# EAGLE design Sychronome driver (EAGLE 7.2.0)
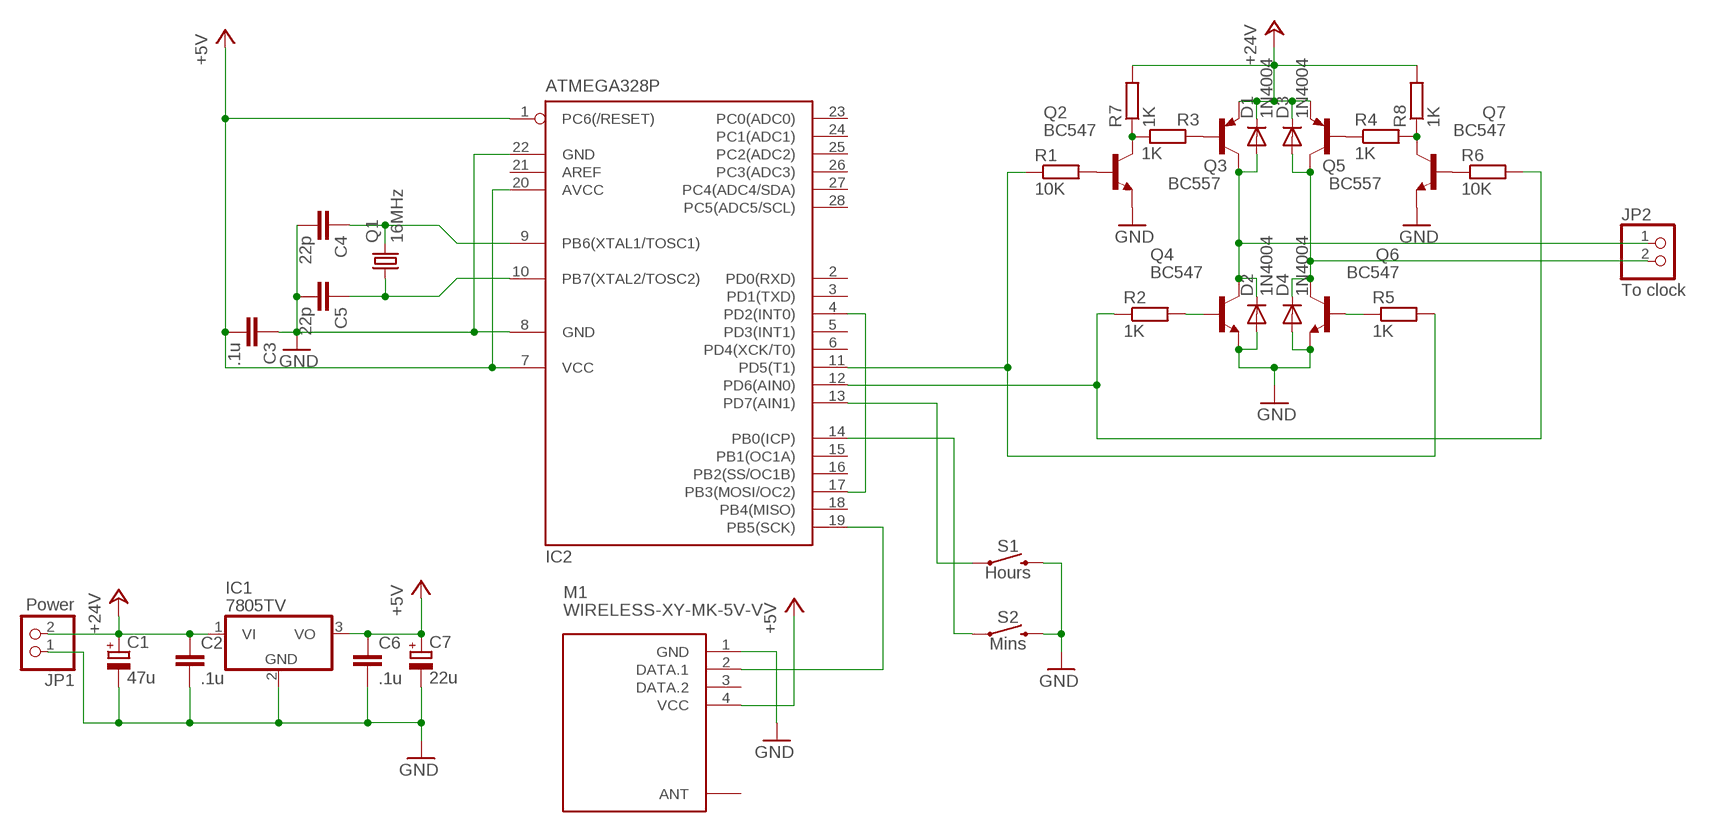
[diagram p0: schematic, sheet 1]

## Parts
C1  47u  CPOL-EUE2.5-7  [E2,5-7]
C2  .1u  C-EU025-024X044  [C025-024X044]
C3  .1u  C-EU025-024X044  [C025-024X044]
C4  22p  C-EU025-024X044  [C025-024X044]
C5  22p  C-EU025-024X044  [C025-024X044]
C6  .1u  C-EU025-024X044  [C025-024X044]
C7  22u  CPOL-EUE2.5-7  [E2,5-7]
D1  1N4004  [DO41-10]
D2  1N4004  [DO41-10]
D3  1N4004  [DO41-10]
D4  1N4004  [DO41-10]
IC1  7805TV  [TO220V]
IC2  ATMEGA328P  MEGA8-P  [DIL28-3]
JP1  Power  PINHD-1X2  [1X02]
JP2  To clock  PINHD-1X2  [1X02]
M1  WIRELESS-XY-MK-5V-V  [WIRELESS-XY-MK-5V#V]
Q1  16MHz  CRYSTALHC49U-V  [HC49U-V]
Q2  BC547  [TO92]
Q3  BC557  [TO92]
Q4  BC547  [TO92]
Q5  BC557  [TO92]
Q6  BC547  [TO92]
Q7  BC547  [TO92]
R1  10K  R-EU_0204/7  [0204/7]
R2  1K  R-EU_0204/7  [0204/7]
R3  1K  R-EU_0204/7  [0204/7]
R4  1K  R-EU_0204/7  [0204/7]
R5  1K  R-EU_0204/7  [0204/7]
R6  10K  R-EU_0204/7  [0204/7]
R7  1K  R-EU_0204/7  [0204/7]
R8  1K  R-EU_0204/7  [0204/7]
S1  Hours  MOMENTARY-SWITCH-SPST-PTH-6.0MM  [TACTILE_SWITCH_PTH_6.0MM]
S2  Mins  MOMENTARY-SWITCH-SPST-PTH-6.0MM  [TACTILE_SWITCH_PTH_6.0MM]

## Nets
+5V: C3.2 C6.1 C7.+ IC1.3(VO) IC2.1(PC6(/RESET)) IC2.7(VCC) IC2.20(AVCC) M1.4(VCC)
+24V: C1.+ C2.1 D1.C D3.C IC1.1(VI) JP1.2 Q3.1(E) Q5.1(E) R7.2 R8.2
GND: C1.- C2.2 C3.1 C4.2 C5.2 C6.2 C7.- D2.A D4.A IC1.2(GND) IC2.8(GND) IC2.22(GND) JP1.1 M1.1(GND) Q2.1(E) Q4.1(E) Q6.1(E) Q7.1(E) S1.3 S2.3
N$1: IC2.12(PD6(AIN0)) R2.1 R6.2
N$2: IC2.4(PD2(INT0)) IC2.17(PB3(MOSI/OC2))
N$18: IC2.13(PD7(AIN1)) S1.1
N$19: IC2.14(PB0(ICP)) S2.1
N$20: IC2.19(PB5(SCK)) M1.2(DATA.1)
N$21: D1.A D2.C JP2.1 Q3.3(C) Q4.3(C)
N$23: D3.A D4.C JP2.2 Q5.3(C) Q6.3(C)
N$24: Q2.2(B) R1.2
N$25: Q3.2(B) R3.2
N$26: Q5.2(B) R4.1
N$27: Q7.2(B) R6.1
N$28: Q2.3(C) R3.1 R7.1
N$29: Q7.3(C) R4.2 R8.1
N$31: IC2.11(PD5(T1)) R1.1 R5.2
N$32: Q4.2(B) R2.2
N$33: Q6.2(B) R5.1
N$45: C4.1 IC2.9(PB6(XTAL1/TOSC1)) Q1.2
N$47: C5.1 IC2.10(PB7(XTAL2/TOSC2)) Q1.1
Unconnected: IC2.2(PD0(RXD)) IC2.3(PD1(TXD)) IC2.5(PD3(INT1)) IC2.6(PD4(XCK/T0)) IC2.15(PB1(OC1A)) IC2.16(PB2(SS/OC1B)) IC2.18(PB4(MISO)) IC2.21(AREF) IC2.23(PC0(ADC0)) IC2.24(PC1(ADC1)) IC2.25(PC2(ADC2)) IC2.26(PC3(ADC3)) IC2.27(PC4(ADC4/SDA)) IC2.28(PC5(ADC5/SCL)) M1.3(DATA.2) M1.ANT

## Library data of the parts
C1 C7 = resistor:CPOL-EU: POLARIZED CAPACITOR, European symbol
C2-C6 = resistor:C-EU: CAPACITOR, European symbol
D1-D4 = diode:1N4004: DIODE general purpose rectifier, 1 A
IC1 = linear:78*: Positive VOLTAGE REGULATOR Source: http://cache.national.com/ds/LM/LM78L05.pdf http://www.fairchildsemi.com/ds/LM/LM7805.pdf
IC2 = atmel:MEGA8-P: MICROCONTROLLER 8 Kbytes FLASH, 1 kbytes SRAM, 512 bytes EEPROM, USART, 4-channel 10 bit ADC, 2-channel 8 bit ADC Pin compatible with Atmega48, ATMega88, ATMega168 Source: avr.lbr; OC_FARNELL: unknown; OC_NEWARK: unknown
JP1 JP2 = pinhead:PINHD-1X2: PIN HEADER
M1 = diy-modules:WIRELESS-XY-MK-5V: RF Wireless XY-MK-5V Receiver Click here to find device on ebay.com <http://www.ebay.com/sch/xd+rf+5v-receiver> Note: Sold together with transmitter.
Q1 = crystal:CRYSTAL: CRYSTAL; OC_FARNELL: 1666969; OC_NEWARK: unknown
Q2 Q4 Q6 Q7 = transistor-npn:BC547*: NPN Transistor
Q3 Q5 = transistor-pnp:BC557: PNP Transistor
R1-R8 = resistor:R-EU_: RESISTOR, European symbol
S1 S2 = SparkFun-Switches:MOMENTARY-SWITCH-SPST: Momentary Switch (Pushbutton) - SPST Normally-open (NO) SPST momentary switches (buttons, pushbuttons). Variants PTH-12MM - 12mm square, through-hole Momentary Pushbutton Switch - 12mm Square <https://www.sparkfun.com/products/9190> (COM-09190) PTH-6.0MM, PTH-6.0MM-KIT - 6.0mm square, through-hole Mini Pushbutton Switch <https://www.sparkfun.com/products/97> (COM-00097) KIT package intended for soldering kit's - only one side of pads' copper is exposed. PTH-RIGHT-ANGLE-KIT - Right-angle, through-hole Right Angle Tactile Button <https://www.sparkfun.com/products/10791> - Used on SparkFun BigTime Watch Kit <https://www.sparkfun.com/products/11734> SMD-12MM - 12mm square, surface-mount Tactile Button - SMD (12mm) <https://www.sparkfun.com/products/12993> (COM-12993) Used on SparkFun PicoBoard <https://www.sparkfun.com/products/11888> SMD-4.5MM - 4.5mm Square Trackball Switch Used on SparkFun Blackberry Trackballer Breakout <https://www.sparkfun.com/products/13169> SMD-4.6MMX2.8MM - 4.60mm x 2.80mm, surface mount Used on SparkFun SAMD21 Mini Breakout <https://www.sparkfun.com/products/13664> SMD-5.2MM, SMD-5.2-REDUNDANT - 5.2mm square, surface-mount Mini Pushbutton Switch - SMD <https://www.sparkfun.com/products/8720> (COM-08720) Used on Arduino Pro Mini <https://www.sparkfun.com/products/11114> REDUNDANT package connects both switch circuits together SMD-6.0X3.5MM - 6.0 x 3.5mm, surface mount Momentary Reset Switch SMD <https://www.sparkfun.com/products/8229> (COM-08229) SMD-6.2MM-TALL - 6.2mm square, surface mount Tactile Button - SMD (6mm) <https://www.sparkfun.com/products/12992> Used on SparkFun Digital Sandbox <https://www.sparkfun.com/products/12651> SMD-RIGHT-ANGLE - Right-angle, surface mount Used on SparkFun Block for Intel® Edison - Arduino <https://www.sparkfun.com/products/13036>; PROD_ID: SWCH-08441; SF_SKU: COM-00097

## Board
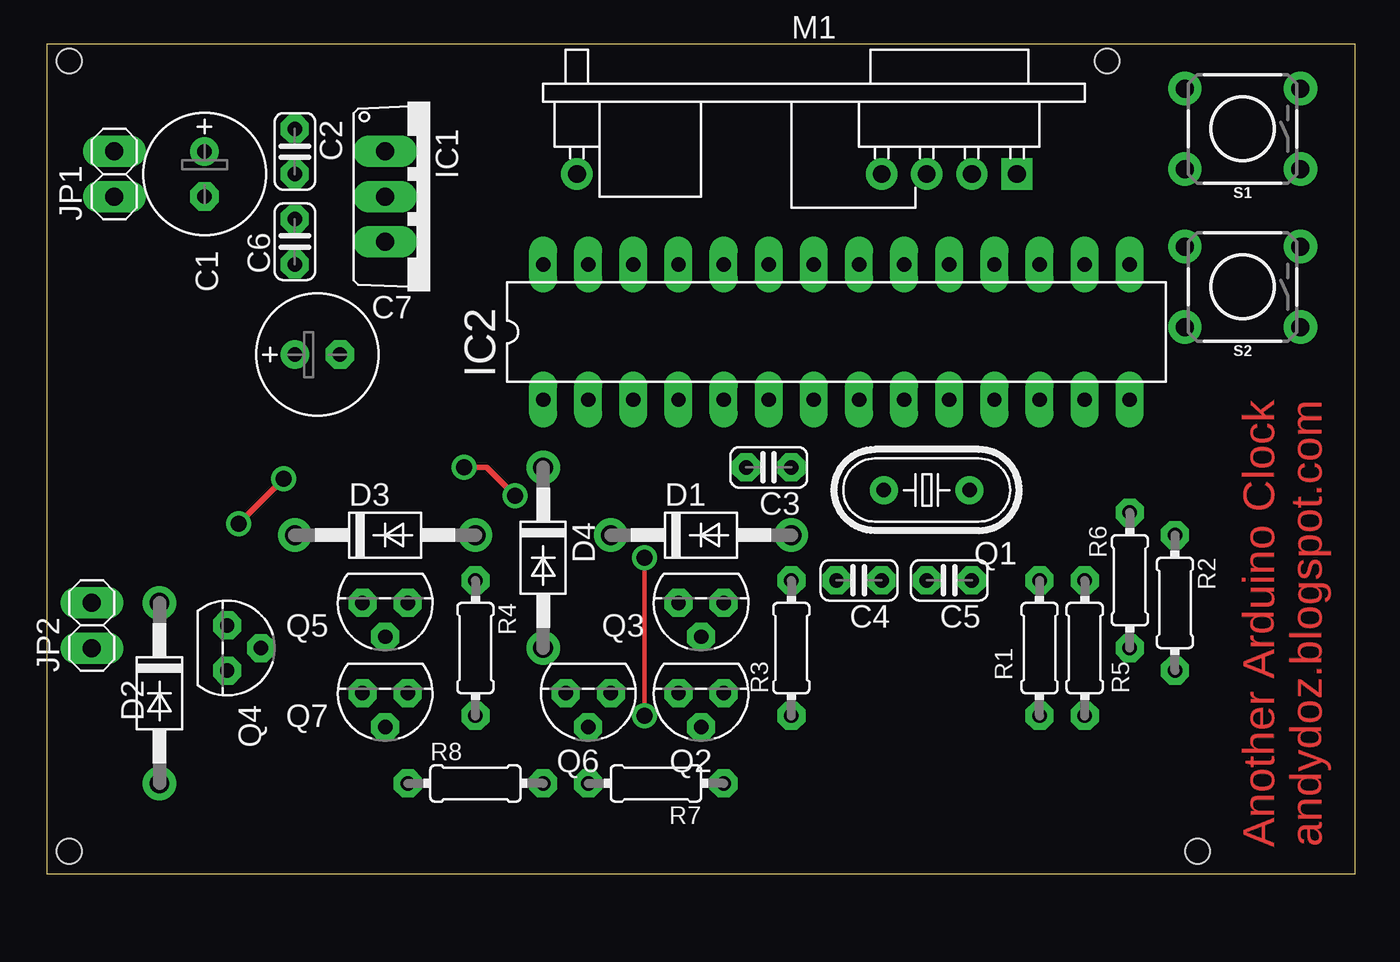
[diagram p1: board, top side]
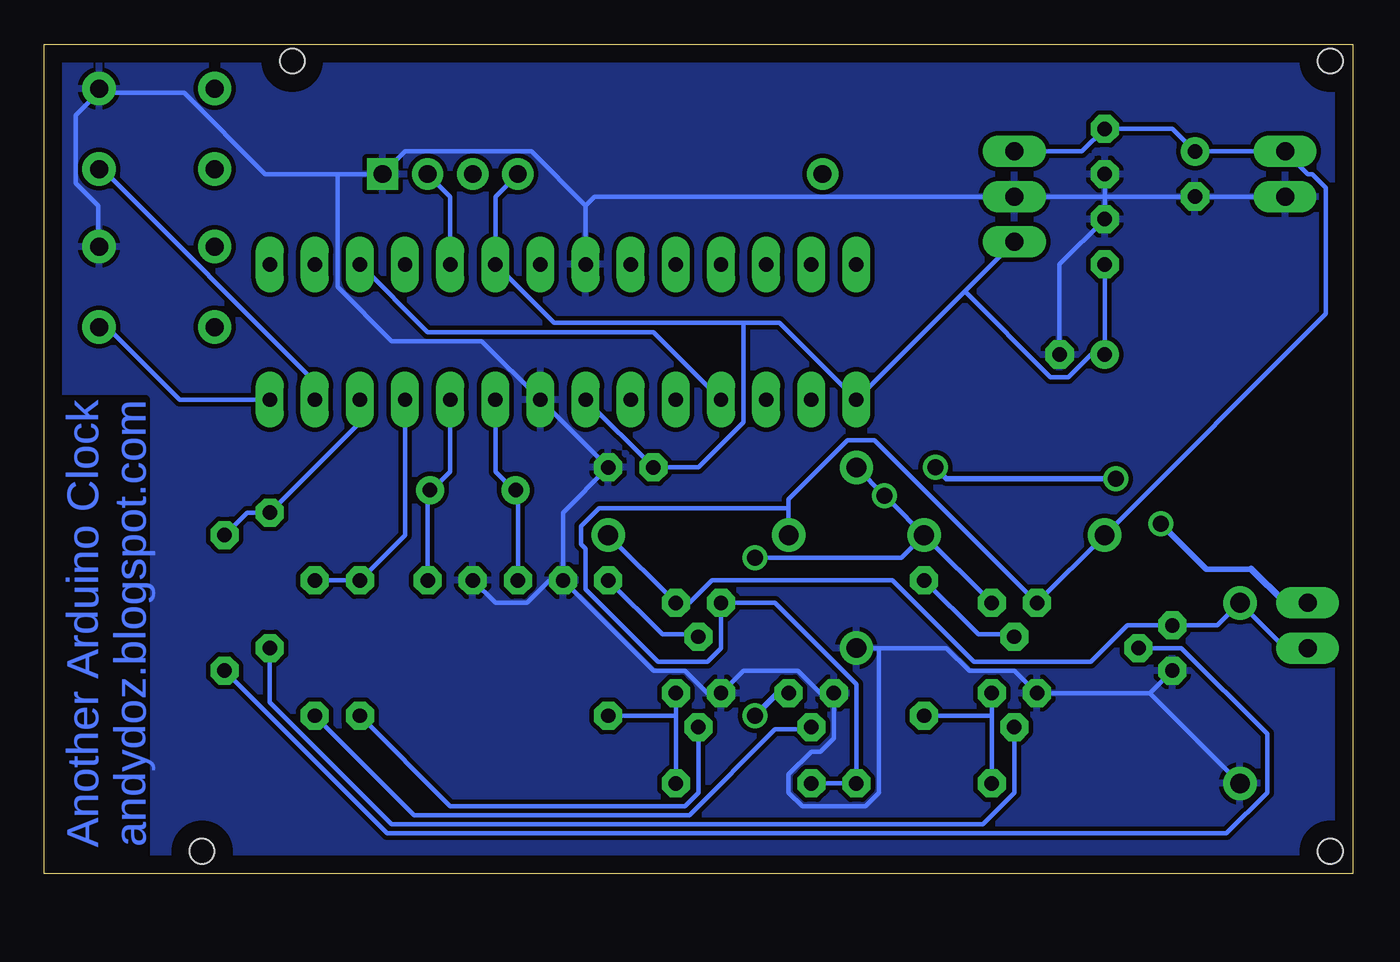
[diagram p2: board, bottom side, seen from below]

Size 73.64 x 46.66 mm. Coordinates in mm from the lower left corner, seen from the top.
Outline: 0,0 73.64,0 73.64,46.66 0,46.66 0,0
Copper layers (1*16): Top 0.035mm / dielectric 1.5mm / Bottom 0.035mm
Design rules "homepcb": minimum track width 10mil, minimum drill 20mil, track to track 10mil, track to pad 10mil, pad to pad 10mil, via to via 10mil, smd to smd 10mil, copper to edge 40mil, drill to drill 10mil, minimum pad ring 15mil, minimum via ring 10mil, stop-mask expansion 0mil, vias tented up to drill 0mil, thermal gap 10mil
Holes 1.4 mm at 1.27,45.72 59.69,45.72 64.77,1.27 1.27,1.27

### Footprints (pad centres in the part's own frame; a part is rotated, then mirrored left to right if it is on the bottom)
E2,5-7 = drill 0.813 pad 1.6: + -1.27,0 | drill 0.813 pad 1.6 octagon: - 1.27,0
C025-024X044 = drill 0.813 octagon: 1 -1.27,0; 2 1.27,0
DO41-10 = drill 1.118: A 5.08,0; C -5.08,0
TO220V = drill 1.016 long: 1 -2.54,-2.54; 2 0,-2.54; 3 2.54,-2.54
DIL28-3 = drill 0.813 long: 1 -16.51,-3.81; 2 -13.97,-3.81; 3 -11.43,-3.81; 4 -8.89,-3.81; 5 -6.35,-3.81; 6 -3.81,-3.81; 7 -1.27,-3.81; 8 1.27,-3.81; 9 3.81,-3.81; 10 6.35,-3.81; 11 8.89,-3.81; 12 11.43,-3.81; 13 13.97,-3.81; 14 16.51,-3.81; 15 16.51,3.81; 16 13.97,3.81; 17 11.43,3.81; 18 8.89,3.81; 19 6.35,3.81; 20 3.81,3.81; 21 1.27,3.81; 22 -1.27,3.81; 23 -3.81,3.81; 24 -6.35,3.81; 25 -8.89,3.81; 26 -11.43,3.81; 27 -13.97,3.81; 28 -16.51,3.81
1X02 = drill 1.016 long: 1 -1.27,0; 2 1.27,0
WIRELESS-XY-MK-5V#V = drill 1 square: 1 11.43,0 | drill 1: 2 8.89,0; 3 6.35,0; 4 3.81,0; ANT -13.335,0
HC49U-V = drill 0.813: 1 -2.413,0; 2 2.413,0
TO92 = drill 0.813 octagon: 1 1.27,0; 2 0,1.905; 3 -1.27,0
0204/7 = drill 0.813 octagon: 1 -3.81,0; 2 3.81,0
TACTILE_SWITCH_PTH_6.0MM = drill 1.016 pad 1.88: 1 -3.251,2.261; 2 3.251,2.261; 3 -3.251,-2.261; 4 3.251,-2.261

### Placement (x,y rotation side)
C1  8.89,39.37 270 top
C2  13.97,40.64 270 top
C3  40.64,22.86 180 top
C4  45.72,16.51 180 top
C5  50.8,16.51 180 top
C6  13.97,35.56 90 top
C7  15.24,29.21 0 top
D1  36.83,19.05 0 top
D2  6.35,10.16 270 top
D3  19.05,19.05 0 top
D4  27.94,17.78 270 top
IC1  21.59,38.1 270 top
IC2  44.45,30.48 0 top
JP1  3.81,39.37 90 top
JP2  2.54,13.97 90 top
M1  43.18,39.37 0 top
Q1  49.53,21.59 180 top
Q2  36.83,10.16 180 top
Q3  36.83,15.24 180 top
Q4  10.16,12.7 270 top
Q5  19.05,15.24 180 top
Q6  30.48,10.16 180 top
Q7  19.05,10.16 180 top
R1  55.88,12.7 270 top
R2  63.5,15.24 270 top
R3  41.91,12.7 90 top
R4  24.13,12.7 270 top
R5  58.42,12.7 90 top
R6  60.96,16.51 90 top
R7  34.29,5.08 180 top
R8  24.13,5.08 0 top
S1  67.31,41.91 180 top
S2  67.31,33.02 180 top

### Tracks (layer width: path | path; a pad name or v marks a point on that pad's centre or on a via)
+5V
  Bottom 0.254: IC2.7 C3.2 36.83,22.86 34.29,25.4 34.29,30.99 | M1.4 48.26,38.1 IC2.20 44.96,30.99 34.29,30.99 | C6.1 C7.+ 14.73,29.21 16,27.94 17.02,27.94 21.84,32.77 | IC1.3 21.84,32.77 | 21.84,32.77 IC2.1 32.26,30.99 34.29,30.99
+24V
  Bottom 0.254: R7.2 R8.2 27.94,10.67 32.51,15.24 Q3.1 35.56,12.7 36.32,11.94 39.12,11.94 43.18,16 43.18,18.29 43.43,18.54 43.43,19.56 42.42,20.57 31.75,20.57 | IC1.1 15.24,40.64 C2.1 10.16,41.91 C1.+ JP1.2 2.54,39.37 2.29,39.37 1.52,38.61 1.52,31.5 D3.C Q5.1 26.92,24.38 28.45,24.38 31.75,21.08 31.75,20.57 | 31.75,20.57 D1.C
GND
  Bottom 0.254: 11.43,10.16 Q7.1 19.05,11.43 21.59,11.43 22.86,12.7 26.67,12.7 | Q4.1 11.43,10.16 | 11.43,10.16 D2.A | 26.67,12.7 D4.A | C4.2 45.21,16.51 46.48,15.24 48.26,15.24 C5.2 | C4.2 44.45,20.32 C3.1 IC2.8 49.02,29.97 54.1,29.97 57.15,33.02 57.15,39.37 | C4.2 39.37,11.43 37.59,11.43 36.32,10.16 Q2.1 34.29,11.43 31.24,11.43 29.97,10.16 Q6.1 29.21,7.62 29.97,6.86 30.48,6.86 31.75,5.59 31.75,4.57 30.99,3.81 27.43,3.81 26.67,4.57 26.67,12.7 | JP1.1 C1.- 13.97,38.1 | C2.2 13.97,38.1 | 13.97,38.1 C6.2 16.51,34.29 C7.- | 13.97,38.1 IC1.2 42.67,38.1 43.18,37.59 | S2.3 70.61,35.31 70.61,37.59 71.88,38.86 71.88,42.67 70.61,43.94 S1.3 70.36,43.94 65.79,43.94 61.21,39.37 57.15,39.37 | 43.18,37.59 IC2.22 | 43.18,37.59 46.23,40.64 53.34,40.64 M1.1 57.15,39.37
  pour Bottom: 0,46.35 73.66,46.35 73.66,0 0,0
N$1
  Bottom 0.254: R2.1 62.23,20.32 R6.2 55.88,25.4 IC2.12
N$2
  Bottom 0.254: IC2.4 39.37,30.48 52.07,30.48 IC2.17
N$18
  Bottom 0.254: IC2.13 58.42,27.69 70.36,39.62 S1.1
N$19
  Bottom 0.254: IC2.14 66.04,26.67 70.36,30.99 S2.1
N$20
  Bottom 0.254: IC2.19 50.8,38.1 M1.2
N$21
  Bottom 0.254: D1.A Q3.3 37.34,15.24 36.07,16.51 25.91,16.51 21.34,11.94 14.73,11.94 12.7,13.97 Q4.3 7.62,13.97 D2.C 3.81,12.7 JP2.1
N$23  (via drill 0.9 pad 0.61)
  Top 0.254: v33.66,8.89 v33.66,17.78
  Top 0.305: v10.79,19.69 v13.34,22.22 | v23.5,22.86 24.77,22.86 v26.35,21.27
  Bottom 0.254: D3.A Q5.3 | D3.A 26.04,20.95 | v26.35,21.27 D4.C | v33.66,17.78 25.4,17.78 D3.A
  Bottom 0.305: 5.71,17.14 8.26,17.14 v10.79,19.69 | v13.34,22.22 22.86,22.22 v23.5,22.86 | v26.35,21.27 26.04,20.95 | Q6.3 32.38,10.16 v33.66,8.89
  Bottom 0.406: JP2.2 3.81,15.24 5.71,17.14
N$24
  Bottom 0.254: Q2.2 36.83,4.57 37.59,3.81 50.8,3.81 R1.2
N$25
  Bottom 0.254: R3.2 38.86,13.46 36.83,13.46 Q3.2
N$26
  Bottom 0.254: R4.1 21.08,13.46 19.05,13.46 Q5.2
N$27
  Bottom 0.254: Q7.2 19.05,4.57 20.83,2.79 54.1,2.79 60.96,9.65 R6.1
N$28
  Bottom 0.254: Q2.3 38.1,8.89 | 38.1,8.89 R7.1 | 38.1,8.89 R3.1
N$29
  Bottom 0.254: Q7.3 20.32,8.89 | 20.32,8.89 R8.1 | 20.32,8.89 R4.2
N$31
  Bottom 0.254: R5.2 R1.1 53.34,19.05 IC2.11
N$32
  Bottom 0.254: R2.2 54.36,2.29 7.11,2.29 4.83,4.57 4.83,7.87 9.65,12.7 Q4.2
N$33
  Bottom 0.254: R5.1 52.83,3.3 37.34,3.3 32.51,8.13 30.48,8.13 Q6.2
N$45
  Bottom 0.254: C4.1 46.99,21.59 Q1.2 47.24,21.59 48.26,22.61 IC2.9
N$47
  Bottom 0.254: C5.1 52.07,21.59 Q1.1 51.82,21.59 50.8,22.61 IC2.10

### Text on the board
Top: Another Arduino Clock / andydoz.blogspot.com
Bottom: Another Arduino Clock / andydoz.blogspot.com | Another Arduino Clock / andydoz.blogspot.com